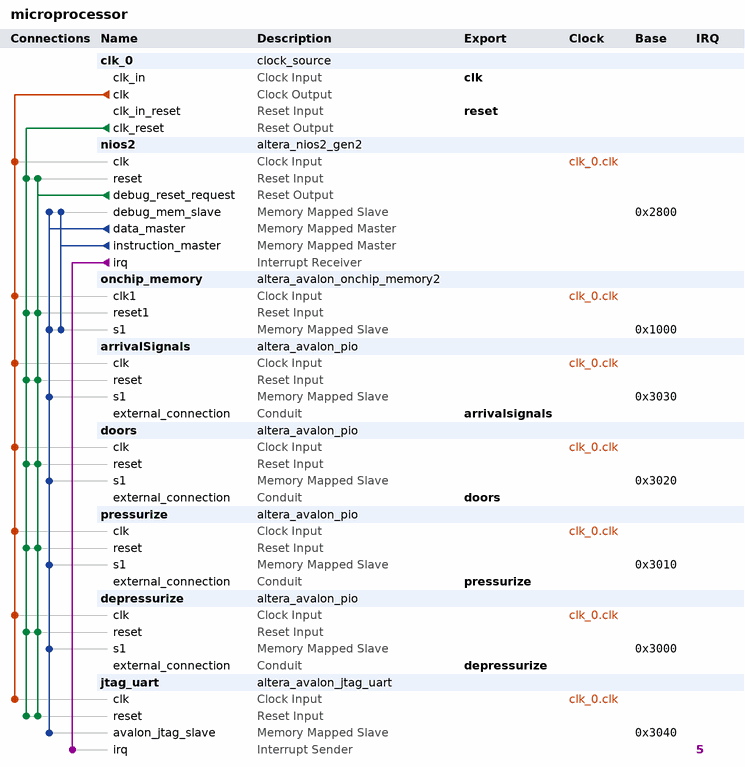
[diagram p0: system contents]
# Platform Designer (Qsys) system microprocessor, Cyclone V 5CSEMA5F31C6
# Parameters at their usual value, and those the tool derives, are not listed.
package require -exact qsys 15.1
create_system microprocessor
set_project_property DEVICE_FAMILY {Cyclone V}
set_project_property DEVICE 5CSEMA5F31C6

add_instance clk_0 clock_source 15.1
set_instance_parameter_value clk_0 clockFrequency 50000000

add_instance nios2 altera_nios2_gen2 15.1
set_instance_parameter_value nios2 dcache_size 2048
set_instance_parameter_value nios2 exceptionSlave onchip_memory.s1
set_instance_parameter_value nios2 icache_size 4096
set_instance_parameter_value nios2 impl Tiny
set_instance_parameter_value nios2 resetSlave onchip_memory.s1

add_instance onchip_memory altera_avalon_onchip_memory2 15.1
set_instance_parameter_value onchip_memory dataWidth 32
set_instance_parameter_value onchip_memory dualPort false
set_instance_parameter_value onchip_memory initMemContent true
set_instance_parameter_value onchip_memory initializationFileName onchip_mem.hex
set_instance_parameter_value onchip_memory memorySize 4096

add_instance arrivalSignals altera_avalon_pio 15.1
set_instance_parameter_value arrivalSignals direction Output
set_instance_parameter_value arrivalSignals width 2

add_instance doors altera_avalon_pio 15.1
set_instance_parameter_value doors direction Output
set_instance_parameter_value doors width 2

add_instance pressurize altera_avalon_pio 15.1
set_instance_parameter_value pressurize direction Output
set_instance_parameter_value pressurize width 1

add_instance depressurize altera_avalon_pio 15.1
set_instance_parameter_value depressurize direction Output
set_instance_parameter_value depressurize width 1

add_instance jtag_uart altera_avalon_jtag_uart 15.1
set_instance_parameter_value jtag_uart simInteractiveOptions NO_INTERACTIVE_WINDOWS

# connections
add_connection clk_0.clk arrivalSignals.clk clock
add_connection clk_0.clk depressurize.clk clock
add_connection clk_0.clk doors.clk clock
add_connection clk_0.clk jtag_uart.clk clock
add_connection clk_0.clk nios2.clk clock
add_connection clk_0.clk onchip_memory.clk1 clock
add_connection clk_0.clk pressurize.clk clock
add_connection clk_0.clk_reset arrivalSignals.reset reset
add_connection clk_0.clk_reset depressurize.reset reset
add_connection clk_0.clk_reset doors.reset reset
add_connection clk_0.clk_reset jtag_uart.reset reset
add_connection clk_0.clk_reset nios2.reset reset
add_connection clk_0.clk_reset onchip_memory.reset1 reset
add_connection clk_0.clk_reset pressurize.reset reset
add_connection nios2.debug_reset_request arrivalSignals.reset reset
add_connection nios2.debug_reset_request depressurize.reset reset
add_connection nios2.debug_reset_request doors.reset reset
add_connection nios2.debug_reset_request jtag_uart.reset reset
add_connection nios2.debug_reset_request nios2.reset reset
add_connection nios2.debug_reset_request onchip_memory.reset1 reset
add_connection nios2.debug_reset_request pressurize.reset reset
add_connection nios2.data_master arrivalSignals.s1 avalon
set_connection_parameter_value nios2.data_master/arrivalSignals.s1 baseAddress 0x3030
add_connection nios2.data_master depressurize.s1 avalon
set_connection_parameter_value nios2.data_master/depressurize.s1 baseAddress 0x3000
add_connection nios2.data_master doors.s1 avalon
set_connection_parameter_value nios2.data_master/doors.s1 baseAddress 0x3020
add_connection nios2.data_master jtag_uart.avalon_jtag_slave avalon
set_connection_parameter_value nios2.data_master/jtag_uart.avalon_jtag_slave baseAddress 0x3040
add_connection nios2.data_master nios2.debug_mem_slave avalon
set_connection_parameter_value nios2.data_master/nios2.debug_mem_slave baseAddress 0x2800
add_connection nios2.data_master onchip_memory.s1 avalon
set_connection_parameter_value nios2.data_master/onchip_memory.s1 baseAddress 0x1000
add_connection nios2.data_master pressurize.s1 avalon
set_connection_parameter_value nios2.data_master/pressurize.s1 baseAddress 0x3010
add_connection nios2.instruction_master nios2.debug_mem_slave avalon
set_connection_parameter_value nios2.instruction_master/nios2.debug_mem_slave baseAddress 0x2800
add_connection nios2.instruction_master onchip_memory.s1 avalon
set_connection_parameter_value nios2.instruction_master/onchip_memory.s1 baseAddress 0x1000
add_connection nios2.irq jtag_uart.irq interrupt
set_connection_parameter_value nios2.irq/jtag_uart.irq irqNumber 5

# exported interfaces
add_interface arrivalsignals conduit end
set_interface_property arrivalsignals EXPORT_OF arrivalSignals.external_connection
add_interface clk clock sink
set_interface_property clk EXPORT_OF clk_0.clk_in
add_interface depressurize conduit end
set_interface_property depressurize EXPORT_OF depressurize.external_connection
add_interface doors conduit end
set_interface_property doors EXPORT_OF doors.external_connection
add_interface pressurize conduit end
set_interface_property pressurize EXPORT_OF pressurize.external_connection
add_interface reset reset sink
set_interface_property reset EXPORT_OF clk_0.clk_in_reset

set_interconnect_requirement {$system} qsys_mm.clockCrossingAdapter HANDSHAKE
set_interconnect_requirement {$system} qsys_mm.enableEccProtection FALSE
set_interconnect_requirement {$system} qsys_mm.insertDefaultSlave FALSE
set_interconnect_requirement {$system} qsys_mm.maxAdditionalLatency 1

save_system microprocessor.qsys
